# EAGLE design v3_LED_IO_board (EAGLE 4.16)
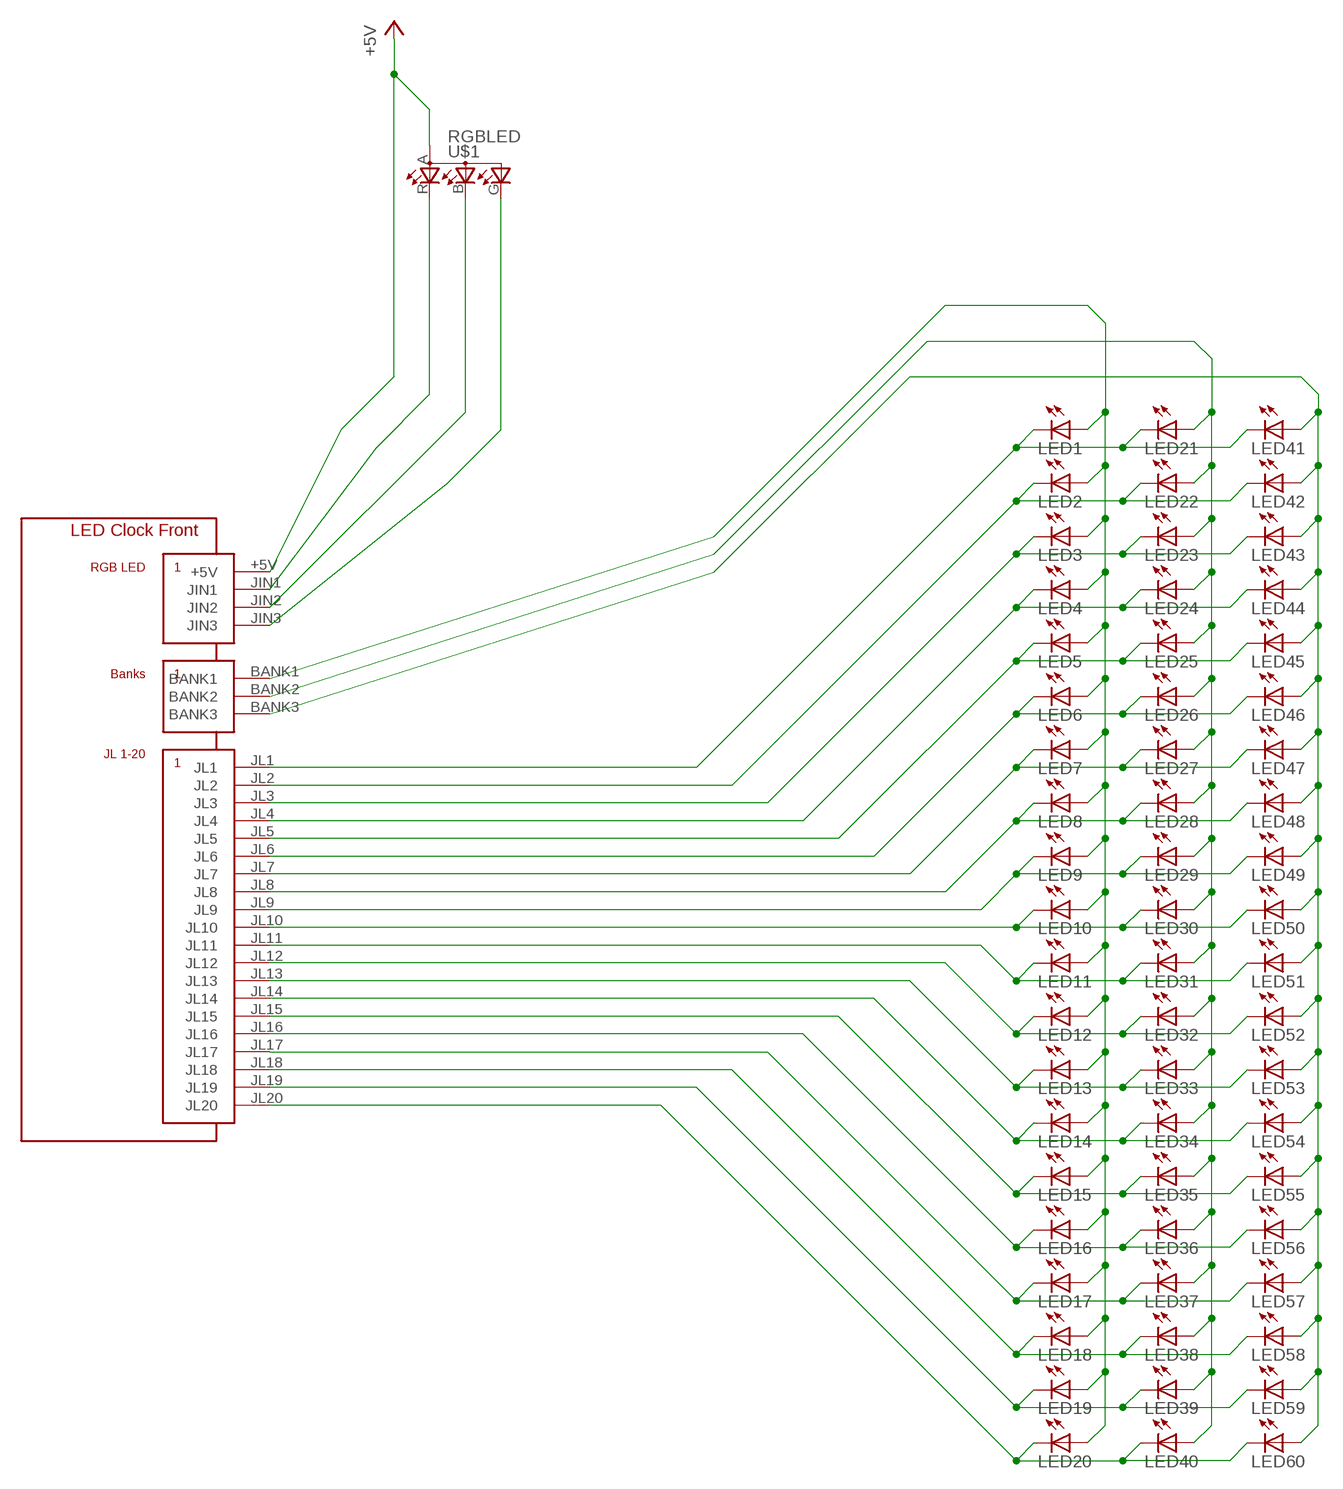
[diagram p0: schematic, sheet 1]

## Parts
LED1  LEDCHIPLED_1206  [CHIPLED_1206]
LED2  LEDCHIPLED_1206  [CHIPLED_1206]
LED3  LEDCHIPLED_1206  [CHIPLED_1206]
LED4  LEDCHIPLED_1206  [CHIPLED_1206]
LED5  LEDCHIPLED_1206  [CHIPLED_1206]
LED6  LEDCHIPLED_1206  [CHIPLED_1206]
LED7  LEDCHIPLED_1206  [CHIPLED_1206]
LED8  LEDCHIPLED_1206  [CHIPLED_1206]
LED9  LEDCHIPLED_1206  [CHIPLED_1206]
LED10  LEDCHIPLED_1206  [CHIPLED_1206]
LED11  LEDCHIPLED_1206  [CHIPLED_1206]
LED12  LEDCHIPLED_1206  [CHIPLED_1206]
LED13  LEDCHIPLED_1206  [CHIPLED_1206]
LED14  LEDCHIPLED_1206  [CHIPLED_1206]
LED15  LEDCHIPLED_1206  [CHIPLED_1206]
LED16  LEDCHIPLED_1206  [CHIPLED_1206]
LED17  LEDCHIPLED_1206  [CHIPLED_1206]
LED18  LEDCHIPLED_1206  [CHIPLED_1206]
LED19  LEDCHIPLED_1206  [CHIPLED_1206]
LED20  LEDCHIPLED_1206  [CHIPLED_1206]
LED21  LEDCHIPLED_1206  [CHIPLED_1206]
LED22  LEDCHIPLED_1206  [CHIPLED_1206]
LED23  LEDCHIPLED_1206  [CHIPLED_1206]
LED24  LEDCHIPLED_1206  [CHIPLED_1206]
LED25  LEDCHIPLED_1206  [CHIPLED_1206]
LED26  LEDCHIPLED_1206  [CHIPLED_1206]
LED27  LEDCHIPLED_1206  [CHIPLED_1206]
LED28  LEDCHIPLED_1206  [CHIPLED_1206]
LED29  LEDCHIPLED_1206  [CHIPLED_1206]
LED30  LEDCHIPLED_1206  [CHIPLED_1206]
LED31  LEDCHIPLED_1206  [CHIPLED_1206]
LED32  LEDCHIPLED_1206  [CHIPLED_1206]
LED33  LEDCHIPLED_1206  [CHIPLED_1206]
LED34  LEDCHIPLED_1206  [CHIPLED_1206]
LED35  LEDCHIPLED_1206  [CHIPLED_1206]
LED36  LEDCHIPLED_1206  [CHIPLED_1206]
LED37  LEDCHIPLED_1206  [CHIPLED_1206]
LED38  LEDCHIPLED_1206  [CHIPLED_1206]
LED39  LEDCHIPLED_1206  [CHIPLED_1206]
LED40  LEDCHIPLED_1206  [CHIPLED_1206]
LED41  LEDCHIPLED_1206  [CHIPLED_1206]
LED42  LEDCHIPLED_1206  [CHIPLED_1206]
LED43  LEDCHIPLED_1206  [CHIPLED_1206]
LED44  LEDCHIPLED_1206  [CHIPLED_1206]
LED45  LEDCHIPLED_1206  [CHIPLED_1206]
LED46  LEDCHIPLED_1206  [CHIPLED_1206]
LED47  LEDCHIPLED_1206  [CHIPLED_1206]
LED48  LEDCHIPLED_1206  [CHIPLED_1206]
LED49  LEDCHIPLED_1206  [CHIPLED_1206]
LED50  LEDCHIPLED_1206  [CHIPLED_1206]
LED51  LEDCHIPLED_1206  [CHIPLED_1206]
LED52  LEDCHIPLED_1206  [CHIPLED_1206]
LED53  LEDCHIPLED_1206  [CHIPLED_1206]
LED54  LEDCHIPLED_1206  [CHIPLED_1206]
LED55  LEDCHIPLED_1206  [CHIPLED_1206]
LED56  LEDCHIPLED_1206  [CHIPLED_1206]
LED57  LEDCHIPLED_1206  [CHIPLED_1206]
LED58  LEDCHIPLED_1206  [CHIPLED_1206]
LED59  LEDCHIPLED_1206  [CHIPLED_1206]
LED60  LEDCHIPLED_1206  [CHIPLED_1206]
U$1  RGBLED  1206_RGBLED  [1206_RGBLED]
U$2  LEDCLOCK_FRONT  [LEDCLOCK_FRONT]

## Nets
+5V: U$1.A(A2) U$2.+5V
LED6: LED6.C LED26.C LED46.C U$2.JL6
N$2: LED9.C LED29.C LED49.C U$2.JL9
N$3: LED1.A LED2.A LED3.A LED4.A LED5.A LED6.A LED7.A LED8.A LED9.A LED10.A LED11.A LED12.A LED13.A LED14.A LED15.A LED16.A LED17.A LED18.A LED19.A LED20.A U$2.BANK1
N$10: LED1.C LED21.C LED41.C U$2.JL1
N$11: LED2.C LED22.C LED42.C U$2.JL2
N$12: LED3.C LED23.C LED43.C U$2.JL3
N$13: LED4.C LED24.C LED44.C U$2.JL4
N$14: LED5.C LED25.C LED45.C U$2.JL5
N$15: U$1.R(CRED) U$2.JIN1
N$16: LED7.C LED27.C LED47.C U$2.JL7
N$17: LED19.C LED39.C LED59.C U$2.JL19
N$19: LED10.C LED30.C LED50.C U$2.JL10
N$20: U$1.B(CBLUE) U$2.JIN2
N$21: U$1.G(CGREEN) U$2.JIN3
N$22: LED8.C LED28.C LED48.C U$2.JL8
N$30: LED21.A LED22.A LED23.A LED24.A LED25.A LED26.A LED27.A LED28.A LED29.A LED30.A LED31.A LED32.A LED33.A LED34.A LED35.A LED36.A LED37.A LED38.A LED39.A LED40.A U$2.BANK2
N$37: LED11.C LED31.C LED51.C U$2.JL11
N$38: LED12.C LED32.C LED52.C U$2.JL12
N$39: LED13.C LED33.C LED53.C U$2.JL13
N$40: LED14.C LED34.C LED54.C U$2.JL14
N$41: LED15.C LED35.C LED55.C U$2.JL15
N$42: LED17.C LED37.C LED57.C U$2.JL17
N$43: LED18.C LED38.C LED58.C U$2.JL18
N$45: LED20.C LED40.C LED60.C U$2.JL20
N$46: LED41.A LED42.A LED43.A LED44.A LED45.A LED46.A LED47.A LED48.A LED49.A LED50.A LED51.A LED52.A LED53.A LED54.A LED55.A LED56.A LED57.A LED58.A LED59.A LED60.A U$2.BANK3
N$47: LED16.C LED36.C LED56.C U$2.JL16

## Library data of the parts
LED1-LED60 = led:LED: LED OSRAM: - CHIPLED LG R971, LG N971, LY N971, LG Q971, LY Q971, LO R971, LY R971 LH N974, LH R974 LS Q976, LO Q976, LY Q976 LO Q996 - Hyper CHIPLED LW Q18S LB Q993, LB Q99A, LB R99A - SideLED LS A670, LO A670, LY A670, LG A670, LP A670 LB A673, LV A673, LT A673, LW A673 LH A674 LY A675 LS A676, LA A676, LO A676, LY A676, LW A676 LS A679, LY A679, LG A679 - Hyper Micro SIDELED® LS Y876, LA Y876, LO Y876, LY Y876 LT Y87S - SmartLED LW L88C, LW L88S LB L89C, LB L89S, LG L890 LS L89K, LO L89K, LY L89K LS L896, LA L896, LO L896, LY L896 - TOPLED LS T670, LO T670, LY T670, LG T670, LP T670 LSG T670, LSP T670, LSY T670, LOP T670, LYG T670 LG T671, LOG T671, LSG T671 LB T673, LV T673, LT T673, LW T673 LH T674 LS T676, LA T676, LO T676, LY T676, LB T676, LH T676, LSB T676, LW T676 LB T67C, LV T67C, LT T67C, LS T67K, LO T67K, LY T67K, LW E67C LS E67B, LA E67B, LO E67B, LY E67B, LB E67C, LV E67C, LT E67C LW T67C LS T679, LY T679, LG T679 LS T770, LO T770, LY T770, LG T770, LP T770 LB T773, LV T773, LT T773, LW T773 LH T774 LS E675, LA E675, LY E675, LS T675 LS T776, LA T776, LO T776, LY T776, LB T776 LHGB T686 LT T68C, LB T68C - Hyper Mini TOPLED® LB M676 - Mini TOPLED Santana® LG M470 LS M47K, LO M47K, LY M47K Source: http://www.osram.convergy.de/
U$1 = catmacey:1206_RGBLED
U$2 = catmacey:LEDCLOCK_FRONT

## Board
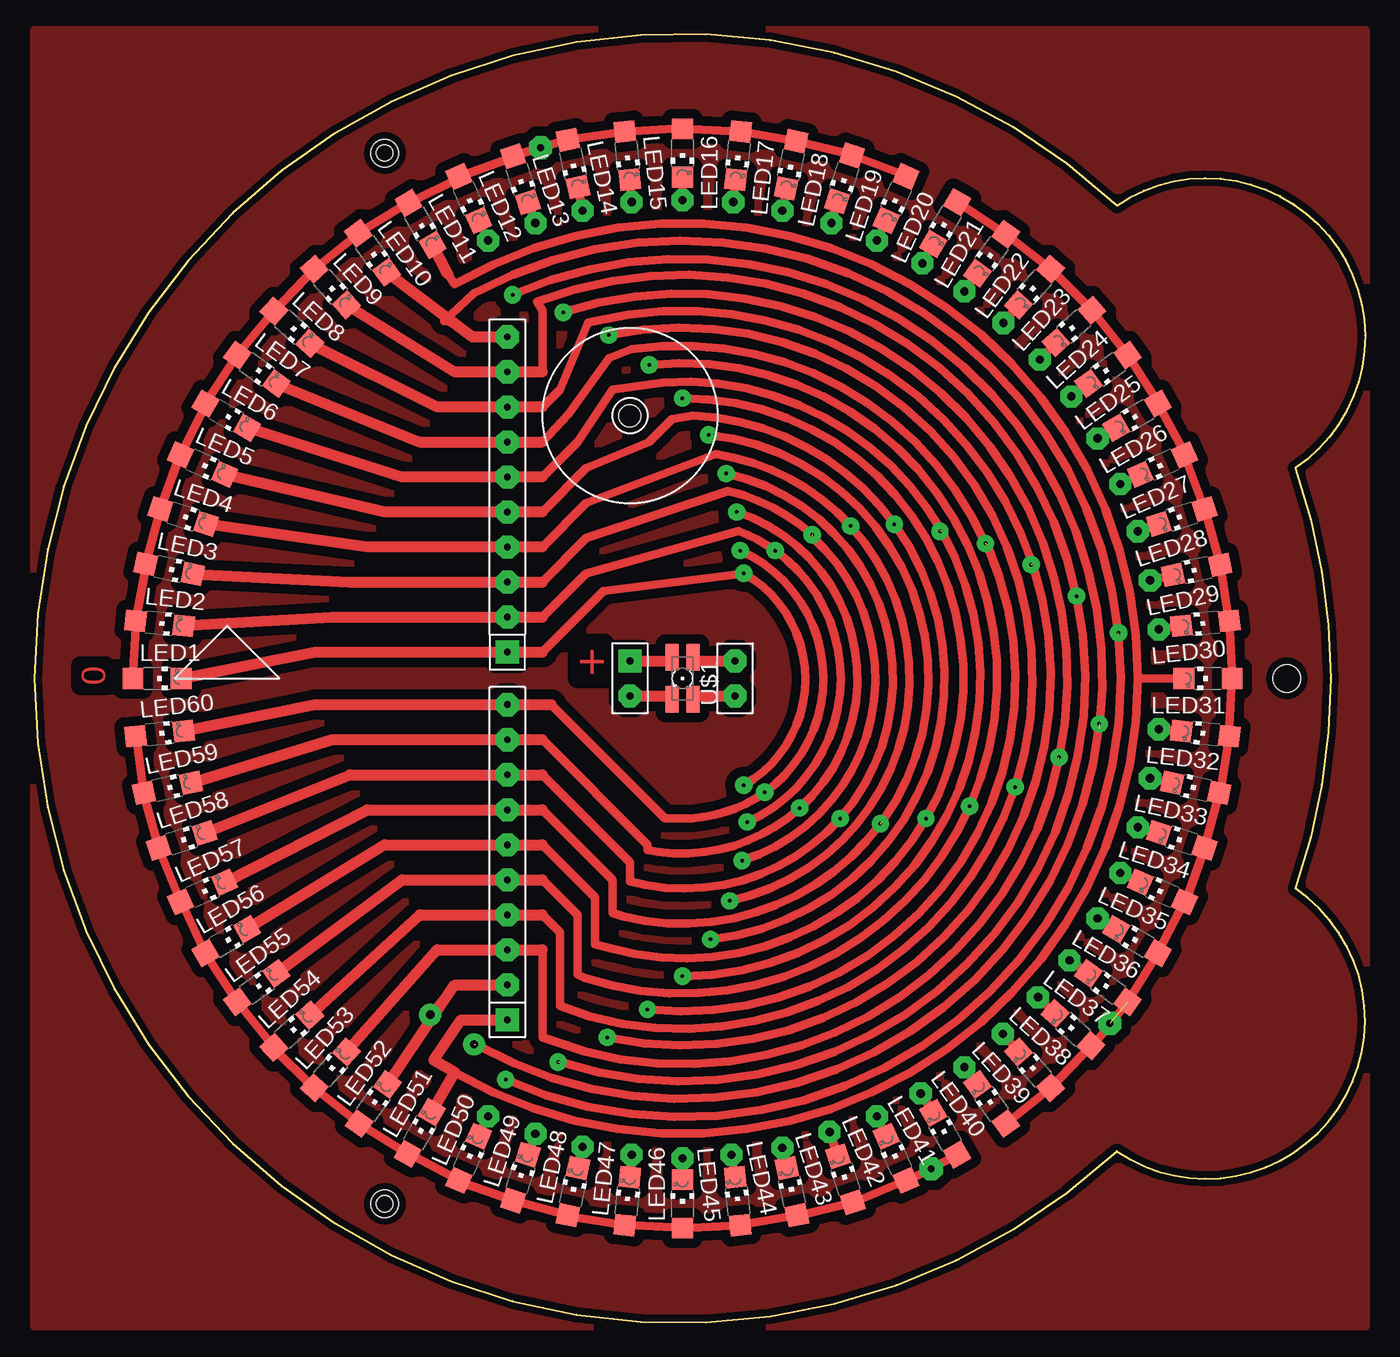
[diagram p1: board, top side]
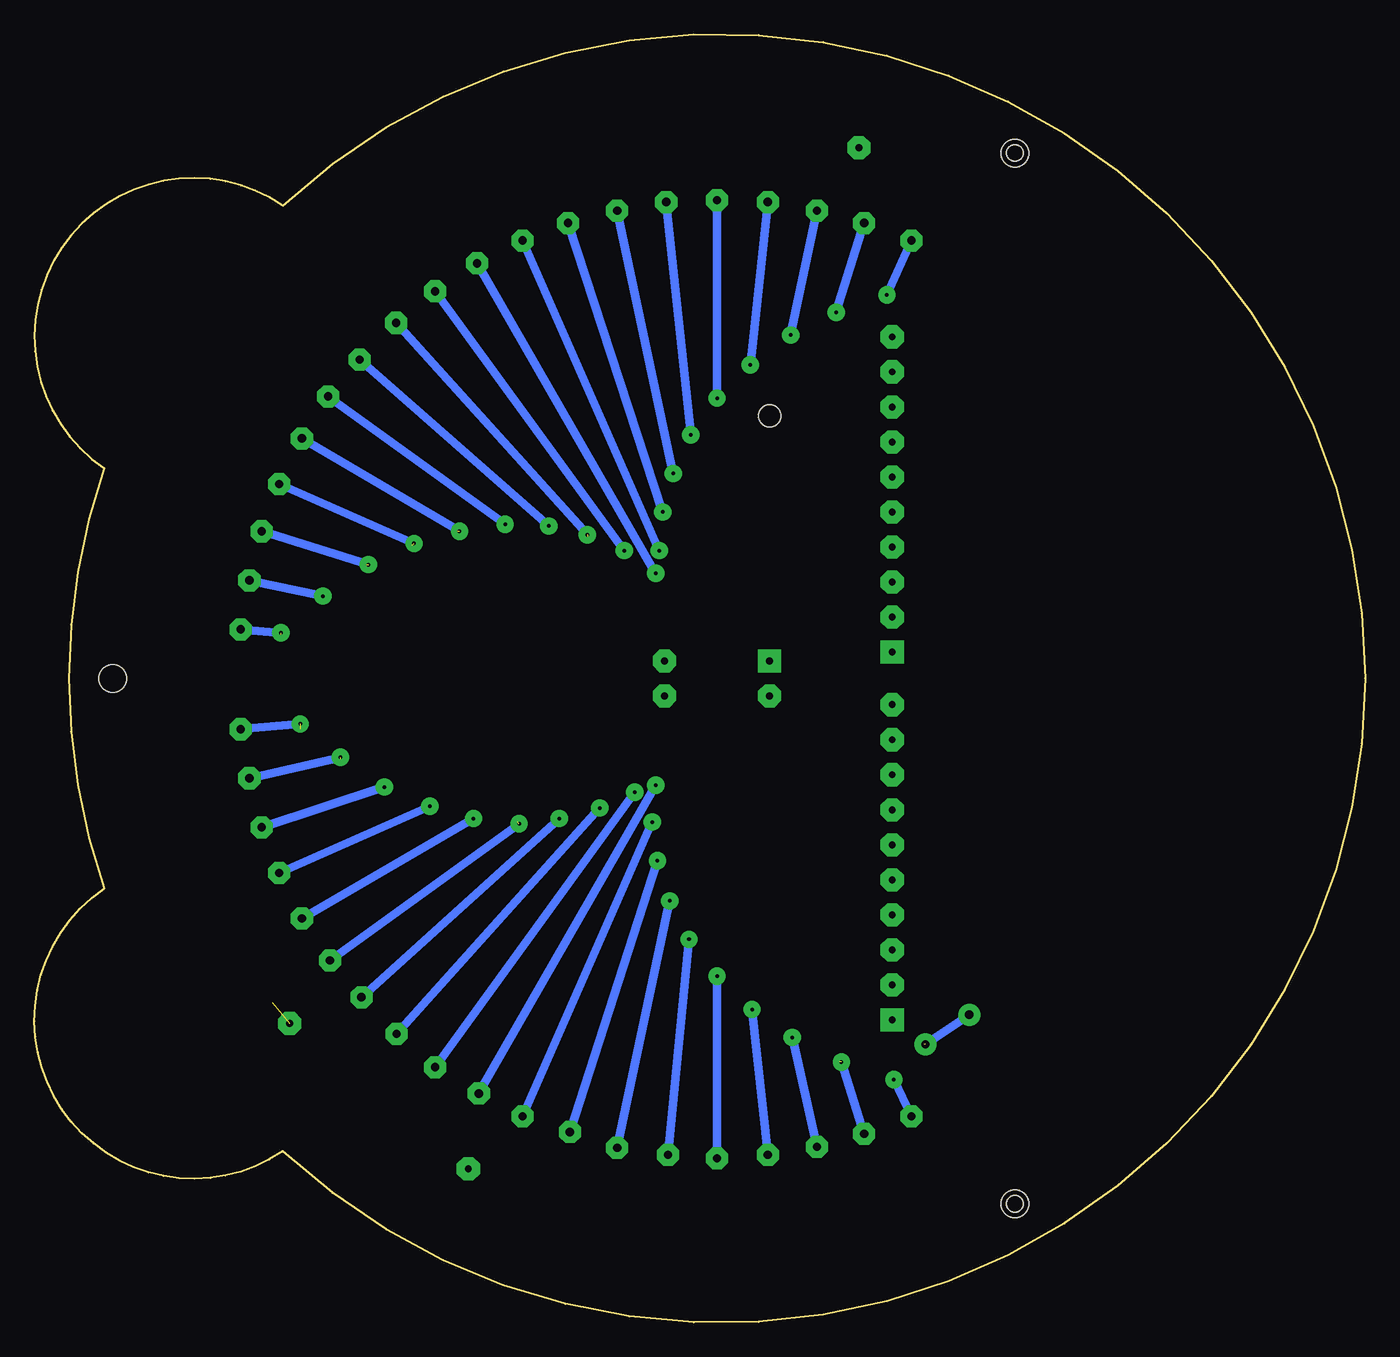
[diagram p2: board, bottom side, seen from below]

Size 96.48 x 93.38 mm. Coordinates in mm from the lower left corner, seen from the top.
Outline: 78.48,80.98 arc266 78.48,12.4 arc180 91.44,31.45 arc38 91.44,61.93 arc180 78.48,80.98
Copper layers (1*16): Top 0.035mm / dielectric 1.5mm / Bottom 0.035mm
Design rules "MJC homemade": minimum track width 0.6mm, minimum drill 0.2mm, track to track 0.7mm, track to pad 0.7mm, pad to pad 0.7mm, via to via 0.7mm, smd to smd 0.7mm, copper to edge 0.5mm, drill to drill 0.5mm, minimum pad ring 0.5mm, minimum via ring 0.5mm, stop-mask expansion 4mil, vias tented up to drill 0mil, thermal gap 0.5mm
Holes 1.2 mm at 25.4,84.79 25.4,8.59
Holes 1.6 mm at 43.18,65.74

### Footprints (pad centres in the part's own frame; a part is rotated, then mirrored left to right if it is on the bottom)
CHIPLED_1206 = smd 1.5 x 1.5: A 0,-1.75; C 0,1.75
1206_RGBLED = smd 1.93 x 0.965: A -1.524,-0.762; B 1.524,-0.762; G 1.524,0.762; R -1.524,0.762
LEDCLOCK_FRONT = drill 0.5 pad 1.676 square: +5V 1.27,3.81; JL1 1.905,12.7; JL11 -24.765,12.7 | drill 0.5 pad 1.676 octagon: BANK1 38.481,10.287; BANK2 -25.019,-30.988; BANK3 -35.56,-18.034; JIN1 1.27,-3.81; JIN2 -1.27,3.81; JIN3 -1.27,-3.81; JL2 4.445,12.7; JL3 6.985,12.7; JL4 9.525,12.7; JL5 12.065,12.7; JL6 14.605,12.7; JL7 17.145,12.7; JL8 19.685,12.7; JL9 22.225,12.7; JL10 24.765,12.7; JL12 -22.225,12.7; JL13 -19.685,12.7; JL14 -17.145,12.7; JL15 -14.605,12.7; JL16 -12.065,12.7; JL17 -9.525,12.7; JL18 -6.985,12.7; JL19 -4.445,12.7; JL20 -1.905,12.7 | hole 2: -38.1,21.59; 38.1,21.59; 0,-43.815

### Placement (x,y rotation side)
LED1  8.89,46.69 270 top
LED2  9.08,50.69 264 top
LED3  9.77,54.63 258 top
LED4  10.79,58.44 252 top
LED5  12.19,62.19 246 top
LED6  13.9,65.74 240 top
LED7  16.12,69.11 234 top
LED8  18.66,72.16 228 top
LED9  21.46,75.08 222 top
LED10  24.51,77.55 216 top
LED11  28,79.65 210 top
LED12  31.49,81.49 204 top
LED13  35.24,82.89 198 top
LED14  39.05,84.03 192 top
LED15  42.99,84.6 186 top
LED16  46.99,84.79 180 top
LED17  51.02,84.6 174 top
LED18  54.86,83.93 168 top
LED19  58.73,82.95 162 top
LED20  62.48,81.49 156 top
LED21  66.04,79.71 150 top
LED22  69.4,77.49 144 top
LED23  72.51,75.08 138 top
LED24  75.37,72.22 132 top
LED25  77.85,69.11 126 top
LED26  79.94,65.74 120 top
LED27  81.78,62.19 114 top
LED28  83.18,58.44 108 top
LED29  84.26,54.57 102 top
LED30  84.9,50.69 96 top
LED31  85.09,46.69 90 top
LED32  84.9,42.69 84 top
LED33  84.2,38.75 78 top
LED34  83.18,34.94 72 top
LED35  81.78,31.2 66 top
LED36  79.94,27.64 60 top
LED37  77.85,24.28 54 top
LED38  75.31,21.23 48 top
LED39  72.51,18.31 42 top
LED40  69.4,15.83 36 top
LED41  66.04,13.67 30 top
LED42  62.48,11.89 24 top
LED43  58.8,10.37 18 top
LED44  54.92,9.48 12 top
LED45  50.99,8.78 6 top
LED46  46.99,8.59 0 top
LED47  42.99,8.78 354 top
LED48  39.05,9.48 348 top
LED49  35.24,10.5 342 top
LED50  31.49,11.89 336 top
LED51  27.94,13.74 330 top
LED52  24.57,15.83 324 top
LED53  21.46,18.31 318 top
LED54  18.66,21.1 312 top
LED55  16.12,24.28 306 top
LED56  13.9,27.64 300 top
LED57  12.19,31.2 294 top
LED58  10.66,34.94 288 top
LED59  9.65,38.75 282 top
LED60  9.08,42.69 276 top
U$1  46.99,46.69 270 top
U$2  46.99,46.69 90 top

### Tracks (layer width: path | path; a pad name or v marks a point on that pad's centre or on a via)
+5V
  Top 0.813: U$1.A 45.97,47.96 U$2.+5V
GND
  pour Top: 0,93.68 96.52,93.68 96.52,-0.3 0,-0.3
LED6  (via drill 0.25, 0.6)  (1 unrouted)
  Top 0.61: 36.83,61.3 39.37,63.84 41.91,67.65 45.59,68.15 arc-64 65.78,57.36 arc-120 v46.99,25.1 | LED46.C v46.99,11.89 | v77.08,64.09 LED26.C
  Top 0.813: LED6.C 26.67,61.3 U$2.JL6 36.83,61.3
  Bottom 0.61: v46.99,11.89 v46.99,25.1 | v65.65,57.36 v77.08,64.09
N$2  (via drill 0.25, 0.6)  (1 unrouted)
  Top 0.61: LED49.C v36.32,13.67 | v80.89,53.8 LED29.C | 36.83,68.92 36.83,73.36 36.44,74 arc-99 v75.56,52.66 arc-120 38.1,18.88
  Top 0.813: LED9.C 30.48,68.92 U$2.JL9 36.83,68.92
  Bottom 0.61: v36.32,13.67 v37.97,18.88 | v75.56,52.66 v80.89,53.8
N$3
  Top 0.61: LED1.A 7.36,50.88 LED2.A 8.12,55.07 LED3.A 9.14,59.01 LED4.A 10.54,62.82 LED5.A 12.44,66.63 LED6.A 14.73,70.19 LED7.A 17.39,73.36 LED8.A 20.32,76.41 LED9.A 23.49,78.95 LED10.A 27.17,81.24 LED11.A 30.86,83.01 LED12.A 34.79,84.54 LED13.A | LED13.A 38.73,85.81 LED14.A 42.79,86.32 LED15.A 46.99,86.57 LED16.A 51.18,86.32 LED17.A 51.11,86.38 LED18.A 59.3,84.66 | LED20.A 63.24,83.14 LED19.A 59.3,84.66 | 59.3,84.66 59.56,85.05 | LED13.A 34.92,84.66 U$2.BANK1
N$10  (via drill 0.25, 0.6)
  Top 0.61: 36.83,48.6 41.27,53.04 v51.43,54.31 arc-121 v51.43,38.94 | 64.85,15.67 LED41.C | 64.85,15.67 v64.26,16.59 64.89,15.7 64.85,15.67 | v64.38,76.79 LED21.C
  Top 0.813: LED1.C 20.32,48.6 U$2.JL1 36.83,48.6
  Bottom 0.61: v51.43,38.94 v64.26,16.59 | v51.43,54.31 v64.38,76.79
N$11  (via drill 0.25, 0.6)
  Top 0.61: 36.83,51.14 40,54.31 51.05,57.36 arc-15 v53.72,55.96 arc-120 v51.68,36.28 | 61.45,14.17 LED42.C | 61.45,14.17 v61.08,14.94 61.46,14.18 61.45,14.17 | v67.43,74.76 LED22.C
  Top 0.813: LED2.C 21.59,51.14 U$2.JL2 36.83,51.14
  Bottom 0.61: v51.68,36.28 v61.08,14.94 | v53.72,55.96 v67.43,74.76
N$12  (via drill 0.25, 0.6)  (1 unrouted)
  Top 0.61: v70.26,72.47 LED23.C | 36.83,53.68 40,56.85 50.29,60.28 arc-29 v56.38,57.11 | LED43.C 57.78,13.42 | 57.78,13.42 v57.65,13.8 57.78,13.42 | v51.3,33.48 arc120 56.38,56.98
  Top 0.813: LED3.C 22.86,53.68 U$2.JL3 36.83,53.68
  Bottom 0.61: v57.65,13.8 v51.3,33.48 | v56.38,57.11 v70.26,72.47
N$13  (via drill 0.25, 0.6)
  Top 0.61: 36.83,56.22 40,59.39 49.4,62.95 arc-39 v59.18,57.74 arc-120 v50.41,30.56 | LED44.C v54.22,12.66 | v72.89,69.81 LED24.C
  Top 0.813: LED4.C 24.13,56.22 U$2.JL4 36.83,56.22
  Bottom 0.61: v54.22,12.66 v50.41,30.56 | v59.18,57.74 v72.89,69.81
N$14  (via drill 0.25, 0.6)
  Top 0.61: 36.83,58.76 40,61.93 44.57,63.84 46.22,65.49 47.75,65.74 arc-52 v62.35,57.87 arc-120 v49.02,27.77 | LED45.C 50.8,10.62 v50.54,12.15 | v75.18,67.14 LED25.C
  Top 0.813: LED5.C 25.4,58.76 U$2.JL5 36.83,58.76
  Bottom 0.61: v50.54,12.15 v49.02,27.77 | v62.35,57.87 v75.18,67.14
N$15
  Top 0.813: U$1.R 48,47.96 U$2.JIN1
N$16  (via drill 0.25, 0.6)  (1 unrouted)
  Top 0.61: LED47.C v43.3,12.15 | v78.74,60.79 LED27.C | v44.45,22.69 arc120 69.08,56.34 | v68.96,56.47 arc74 43.3,70.57 41.65,69.93 38.73,65.87 36.83,63.84
  Top 0.813: LED7.C 27.94,63.84 U$2.JL7 36.83,63.84
  Bottom 0.61: v43.3,12.15 v44.45,22.69 | v68.96,56.47 v78.74,60.79
N$17  (via drill 0.25, 0.6)
  Top 0.61: 36.83,42.25 44.45,34.63 44.45,34.25 45.21,34.12 arc50 v55.49,37.29 arc120 v50.92,58.76 | 58.01,80.61 LED19.C | 58.01,80.61 v57.78,79.71 58.03,80.6 58.01,80.61 | v70.23,20.91 LED39.C
  Top 0.813: LED59.C 21.59,42.25 U$2.JL19 36.83,42.25
  Bottom 0.61: v50.92,58.76 v57.78,79.71 | v55.49,37.29 v70.23,20.91
N$19  (via drill 0.25, 0.6)  (1 unrouted)
  Top 0.406: 31.75,71.46 29.71,72.6
  Top 0.61: LED50.C 32.25,13.67 v32.89,14.94 | v81.53,50.25 LED30.C | v34.16,17.61 arc120 78.61,49.87 | v78.61,49.99 arc112 31.87,74.63 29.71,72.6
  Top 0.813: LED10.C 31.75,71.46 U$2.JL10
  Bottom 0.61: v32.89,14.94 v34.16,17.61 | v78.61,49.99 v81.53,50.25
N$20
  Top 0.813: U$1.B 45.97,45.42 U$2.JIN2
N$21
  Top 0.813: U$1.G 48,45.42 U$2.JIN3
N$22  (via drill 0.25, 0.6)  (1 unrouted)
  Top 0.61: LED48.C v39.75,12.72 | v80.01,57.36 LED28.C | 36.83,66.38 38.1,67.65 40.13,72.47 40.64,72.6 arc-85 72.39,54.95 arc-120 v41.52,20.66
  Top 0.813: LED8.C 29.21,66.38 U$2.JL8 36.83,66.38
  Bottom 0.61: v39.75,12.72 v41.52,20.66 | v72.26,54.95 v80.01,57.36
N$30  (1 unrouted)
  Top 0.61: LED21.A 70.35,78.95 LED22.A 73.66,76.41 LED23.A 76.7,73.36 LED24.A | LED24.A 79.24,70.19 LED25.A 81.53,66.63 LED26.A 83.43,62.95 LED27.A 84.83,59.01 LED28.A 85.97,54.95 LED29.A 86.61,50.88 LED30.A 86.86,46.69 LED31.A 86.61,42.5 LED32.A 85.97,38.44 LED33.A 84.83,34.37 LED34.A 83.43,30.44 LED35.A 81.4,26.75 LED36.A 79.24,23.2 LED37.A 76.7,20.02 LED38.A | LED38.A 73.66,16.97 LED39.A 70.48,14.43 LED40.A | LED24.A 76.7,73.49 | LED38.A 76.7,19.89
N$37
  Top 0.61: LED51.C 28.82,15.32 | 29.97,76.03 30.48,75.27 arc-120 80.01,46.69 | 80.01,46.69 LED31.C | 30.48,18.12 arc120 80.01,46.69
  Top 0.813: 28.82,15.32 30.48,18.12 28.95,19.01 30.93,21.93 U$2.JL11 | 29.97,76.03 LED11.C
N$38  (via drill 0.25, 0.6)  (2 unrouted)
  Top 0.61: 30.48,24.47 v28.7,22.31 | v32.89,78.44 LED12.C | v81.53,43.01 LED32.C | v34.67,74.5 arc-121 77.21,43.01 | 32,20.15 arc113 v77.21,43.39
  Top 0.813: LED52.C 30.48,24.47 U$2.JL12
  Bottom 0.61: v28.7,22.31 v31.87,20.15 | v34.67,74.5 v32.89,78.44 | v77.21,43.39 v81.53,43.01
N$39  (via drill 0.25, 0.6)  (1 unrouted)
  Top 0.61: 36.83,27.01 36.83,20.66 39.87,19.64 arc93 74.29,40.85 arc120 v38.35,73.23 | v36.32,79.71 LED13.C | v80.89,39.45 LED33.C
  Top 0.813: LED53.C 29.21,27.01 U$2.JL13 36.83,27.01
  Bottom 0.61: v38.35,73.23 v36.32,79.71 | v74.29,40.98 v80.89,39.45
N$40  (via drill 0.25, 0.6)
  Top 0.61: v39.75,80.6 LED14.C | 36.83,29.55 38.1,28.28 38.1,22.94 40.25,22.18 arc87 v71.12,38.82 arc120 v41.65,71.58 | v80.01,35.9 LED34.C
  Top 0.813: LED54.C 27.94,29.55 U$2.JL14 36.83,29.55
  Bottom 0.61: v41.65,71.58 v39.75,80.6 | v71.12,38.82 v80.01,35.9
N$41  (via drill 0.25, 0.6)
  Top 0.61: 36.83,32.09 39.37,29.55 39.37,25.23 39.87,24.97 arc84 v67.81,37.42 arc120 v44.57,69.42 | v43.3,81.24 LED15.C | v78.74,32.59 LED35.C
  Top 0.813: LED55.C 26.67,32.09 U$2.JL15 36.83,32.09
  Bottom 0.61: v44.57,69.42 v43.3,81.24 | v67.81,37.42 v78.74,32.59
N$42  (via drill 0.25, 0.6)  (1 unrouted)
  Top 0.61: 36.83,37.17 41.91,32.09 41.91,29.67 42.67,29.42 arc67 v61.34,36.15 | LED17.C 50.8,82.89 v50.67,81.24 | v75.05,26.24 LED37.C | 61.46,36.28 arc120 v48.89,64.34
  Top 0.813: LED57.C 24.13,37.17 U$2.JL17 36.83,37.17
  Bottom 0.61: v48.89,64.34 v50.67,81.24 | v61.34,36.15 v75.05,26.24
N$43  (via drill 0.25, 0.6)
  Top 0.61: 36.83,39.71 43.18,33.36 43.18,31.96 44.32,31.71 arc59 v58.42,36.53 arc119 v50.16,61.55 | LED18.C 54.48,82.12 v54.22,80.6 | v72.77,23.58 LED38.C
  Top 0.813: LED58.C 22.86,39.71 U$2.JL18 36.83,39.71
  Bottom 0.61: v50.16,61.55 v54.22,80.6 | v58.42,36.53 v72.77,23.58
N$45  (via drill 0.25, 0.25 pad 0.25, 0.6)
  Top 0.61: 37.46,44.79 45.72,36.53 46.86,36.53 arc37 v52.95,38.44 arc120 v51.18,55.96 | v61.08,78.44 LED20.C | v67.43,18.5 LED40.C
  Top 0.813: LED60.C 20.32,44.79 U$2.JL20 37.46,44.79
  Bottom 0.61: v51.18,55.96 v61.08,78.44 | v52.95,38.44 v67.43,18.5
N$46
  Top 0.406: LED42.A 63.31,10.25 U$2.BANK3
  Top 0.61: LED42.A 63.24,10.24 LED41.A | LED42.A 59.43,8.72 LED43.A 55.24,7.7 LED44.A 51.18,7.07 LED45.A 46.99,6.81 LED46.A 42.79,7.07 LED47.A 38.73,7.7 LED48.A 34.67,8.85 LED49.A | LED49.A 30.73,10.24 LED50.A 27.05,12.27 LED51.A 23.49,14.43 LED52.A 20.32,16.97 LED53.A 17.27,19.89 LED54.A 14.73,23.2 LED55.A 12.44,26.63 LED56.A 10.66,30.44 LED57.A 9.01,34.37 LED58.A 7.87,38.44 LED59.A 7.36,42.5 LED60.A | LED49.A 34.67,8.59 | LED42.A 63.37,10.24
N$47  (via drill 0.25, 0.6)
  Top 0.61: 36.83,34.63 40.64,30.82 40.64,27.39 41.65,27.13 arc75 v64.64,36.53 arc120 v46.99,67.01 | v46.99,81.36 LED16.C | v77.08,29.29 LED36.C
  Top 0.813: LED56.C 25.4,34.63 U$2.JL16 36.83,34.63
  Bottom 0.61: v46.99,67.01 v46.99,81.36 | v64.64,36.53 v77.08,29.29

### Text on the board
Top: + | 0